# Altium project EC-Sensor-Module.PrjPcb
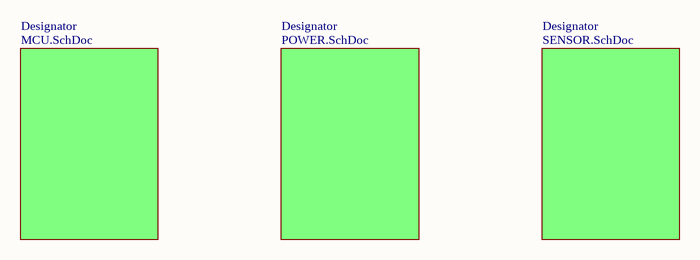
[diagram p0: Integrate.SchDoc]
SoftwareVersion: AD20; VersionRevision: Rev1; Project: Electrochemical Sensor Module; Name: MosesChan; Company: Yeejoin
4 sheets, 57 parts. Net scope: flat (ports and power ports of the same name join across sheets).
Sheets:
  Integrate.SchDoc
    Designator = MCU.SchDoc
    Designator = POWER.SchDoc
    Designator = SENSOR.SchDoc

## Sheet Integrate.SchDoc
size A

### Sub-sheets
Designator = MCU.SchDoc: no entries
Designator = POWER.SchDoc: no entries
Designator = SENSOR.SchDoc: no entries

## Sheet MCU.SchDoc
size A
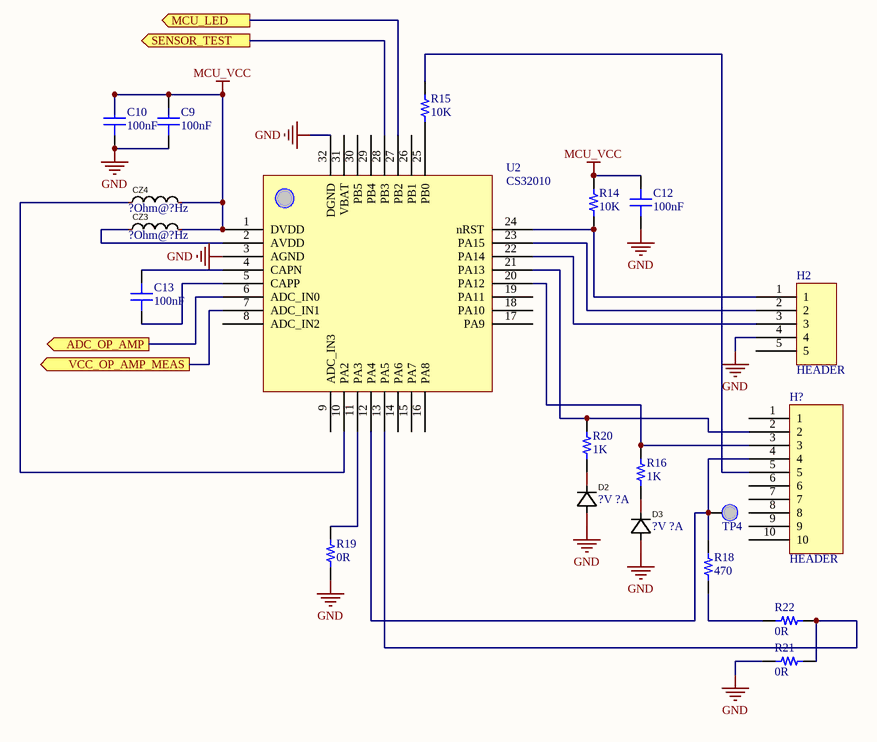
[diagram p1: MCU.SchDoc]

### Parts
(Parts that share a designator on the sheet are numbered #1, #2 ... from top to bottom, then left to right.)
C9  100nF  [0603_C]
C10  100nF  [0603_C]
C12  100nF  [0603_C]
C13  100nF  [0603_C]
CZ3  ?Ohm@?Hz  [L0603]
CZ4  ?Ohm@?Hz  [L0603]
D2  ?V ?A
D3  ?V ?A
H2  HEADER
H?  HEADER
R14  10K  [0402_R]
R15  10K  [0402_R]
R16  1K  [0402_R]
R18  470  [0402_R]
R19#1  0R  [0402_R]
R20  1K  [0402_R]
R21  0R  [0402_R]
R22#1  0R  [0402_R]
TP4  TP  (value not drawn)
U2  CS32010  (net tie)

### Ports
ADC_OP_AMP (out), MCU_LED (out), SENSOR_TEST (out), VCC_OP_AMP_MEAS (out)

### Nets
GND: C9.1 C10.1 C12.1 D2.2(A) D3.2(A) H2.4 R19#1.1 R21.2 U2.3(AGND) U2.32(DGND)
MCU_VCC: C9.2 C10.2 C12.2 CZ3.2 CZ4.2 R14.2 U2.1(DVDD)
NetC3_2: U2.28(PB3) ; port SENSOR_TEST
NetC4_1: U2.7(ADC_IN1) ; port VCC_OP_AMP_MEAS
NetC13_1: C13.1 U2.5(CAPP)
NetC13_2: C13.2 U2.4(CAPN)
NetCZ3_1: CZ3.1 U2.2(AVDD)
NetCZ4_1: CZ4.1 U2.10(PA2)
NetD2_1: D2.1(K) R20.1
NetD3_1: D3.1(K) R16.1
NetH2_1: H2.1 R14.1 U2.24(nRST)
NetH2_2: H2.2 U2.23(PA15)
NetH2_3: H2.3 U2.22(PA14)
NetH?_2: H?.2 R20.2 U2.21(PA13)
NetH?_3: H?.3 R16.2 U2.20(PA12)
NetH?_4: H?.4 R18.2 TP4.8 U2.12(PA4)
NetH?_5: H?.5 R15.1
NetR5_2: U2.27(PB2) ; port MCU_LED
NetR9_2: U2.6(ADC_IN0) ; port ADC_OP_AMP
NetR15_2: R15.2 U2.25(PB0)
NetR18_1: R18.1 R22#1.2
NetR19#1_2: R19#1.2 U2.11(PA3)
NetR21_1: R21.1 R22#1.1 U2.13(PA5)

Not connected (* = marked no-connect by the designer): H2 5; H? 1 6 7 8 9 10; U2 8(ADC_IN2) 9(ADC_IN3) 14(PA6) 15(PA7) 16(PA8) 17(PA9) 18(PA10) 19(PA11) 26(PB1) 29(PB4) 30(PB5) 31(VBAT)

### Library data of the parts
C9 C10 C12 C13 = C0603: SMT Capacitor
CZ3 CZ4 = Bead: Common Smd Bead; Manufacturer: muRata(村田); Name: BLM18AG601SN1D; Add into BOM: yes; Impedance @ Frequency: 600Ω@100MHz; Tolerance: ±25%; DC Resistance: 380mΩ; Current Rating: 500mA; Circuits: 1; Symbol: BLM18AG601SN1D; Device: BLM18AG601SN1D; LCSC Part Name: 单路 0603磁珠 阻抗600Ω@100MHz; Supplier Part: C19330; Manufacturer Part: BLM18AG601SN1D; Supplier Footprint: 0603; JLCPCB Part Class: Extended Part; Datasheet: https://atta.szlcsc.com/upload/public/pdf/source/20180326/C19330_93F4AC33FF94C8E22511353688ADC0FA.pdf; Supplier: LCSC; Convert to PCB: yes
D2 D3 = Diode: Manufacturer: TWGMC(台湾迪嘉); Name: 1N4007; Symbol: 1N4007_C727081; Add into BOM: yes; Forward Voltage (Vf@If): 1.1V 1A; Reverse Leakage Current: 5uA 1kV; Reverse Voltage (Vr): 1kV; Diode Configuration: 独立式; Average Rectified Current (Io): 1A; Device: 1N4007_C727081; LCSC Part Name: 1N4007; Supplier Part: C727081; Manufacturer Part: 1N4007; Supplier Footprint: SMA(DO-214AC); JLCPCB Part Class: Extended Part; Datasheet: https://atta.szlcsc.com/upload/public/pdf/source/20200828/C727079_3A05254382567072883400655AE0ED46.pdf; Supplier: LCSC; Convert to PCB: yes
H2 = HEADER 5: 2.54mm spacing HEADER
H? = HEADER 10: 2.54mm spacing HEADER
R14-R16 R18 R19#1 R20 R21 R22#1 = R0402: SMT Resistor
TP4 = TP: Test Point
U2 = CS32010: ChipSea Microcontroller

## Sheet POWER.SchDoc
size A
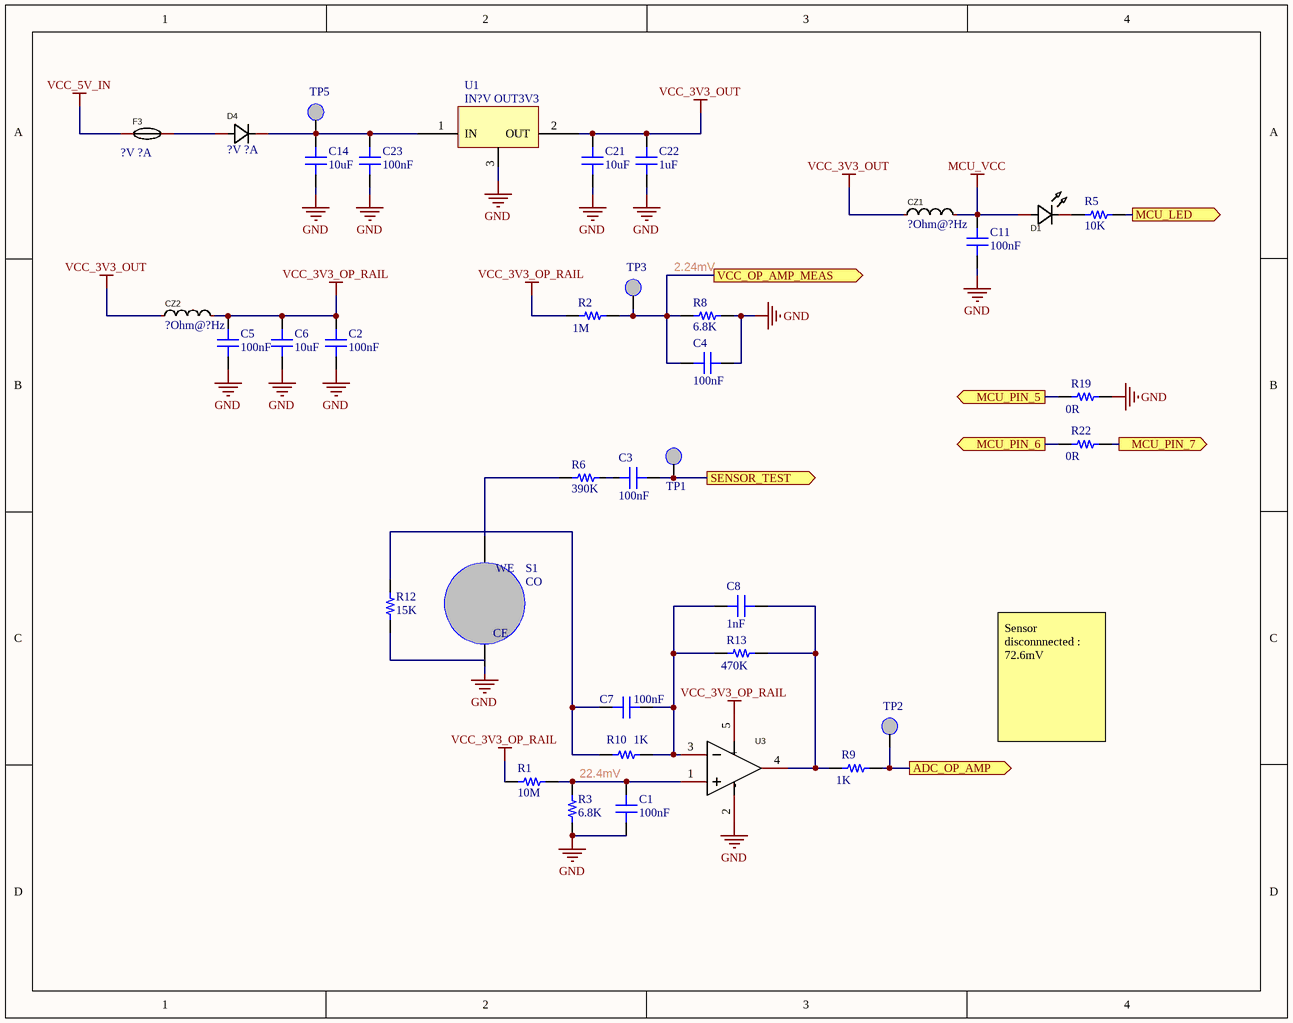
[diagram p2: POWER.SchDoc]

### Parts
(Parts that share a designator on the sheet are numbered #1, #2 ... from top to bottom, then left to right.)
C1  100nF  [0402_C]
C2  100nF  [0402_C]
C3  100nF  [0402_C]
C4  100nF  [0402_C]
C5  100nF  [0402_C]
C6  10uF  [0402_C]
C7  100nF  [0402_C]
C8  1nF  [0402_C]
C11  100nF  [0402_C]
C14  10uF  [0603_C]
C21  10uF  [0603_C]
C22  1uF  [0402_C]
C23  100nF  [0402_C]
CZ1  ?Ohm@?Hz  [L0603]
CZ2  ?Ohm@?Hz  [L0603]
D1  MHK1375CRBTD  [LED-TH_MHK1375CRBTD]  (value not drawn)
D4  ?V ?A
F3  ?V ?A  [F1206]
R1  10M  [0402_R]
R2  1M  [0402_R]
R3  6.8K  [0402_R]
R5  10K  [0402_R]
R6  390K  [0402_R]
R8  6.8K  [0402_R]
R9  1K  [0402_R]
R10  1K  [0402_R]
R12  15K  [0402_R]
R13  470K  [0402_R]
R19#2  0R  [0402_R]
R22#2  0R  [0402_R]
S1  CO
TP1  TP  (value not drawn)
TP2  TP  (value not drawn)
TP3  TP  (value not drawn)
TP5  TP  (value not drawn)
U1  IN?V OUT3V3
U3  Op-Amp  [SOT-23-5_L3.0-W1.7-P0.95-LS2.8-BR]  (value not drawn)

### Ports
ADC_OP_AMP (out), MCU_LED (out), MCU_PIN_5 (out), MCU_PIN_6 (out), MCU_PIN_7 (out), SENSOR_TEST (out), VCC_OP_AMP_MEAS (out)

### Nets
GND: C1.2 C2.2 C4.2 C5.2 C6.2 C11.2 C14.1 C21.1 C22.2 C23.2 R3.2 R8.2 R19#2.2 S1.6 U1.3(GND) U3.2(-)
MCU_VCC: C11.1 CZ1.2 D1.1(A)
VCC_3V3_OP_RAIL: C2.1 C5.1 C6.1 CZ2.2 R1.2 R2.1 U3.5(+)
VCC_3V3_OUT: C21.2 C22.1 CZ1.1 CZ2.1 U1.2(OUT)
VCC_5V_IN: F3.1
NetC1_1: C1.1 R1.1 R3.1 U3.1(+IN)
NetC3_1: C3.1 R6.1
NetC3_2: C3.2 TP1.8 ; port SENSOR_TEST
NetC4_1: C4.1 R2.2 R8.1 TP3.8 ; port VCC_OP_AMP_MEAS
NetC7_1: C7.1 R10.2 R12.1
NetC7_2: C7.2 C8.1 R10.1 R13.1 U3.3(-IN)
NetC8_2: C8.2 R9.1 R13.2 U3.4(OUT)
NetC14_2: C14.2 C23.1 D4.1(K) TP5.8 U1.1(IN)
NetD1_2: D1.2(K) R5.1
NetD4_2: D4.2(A) F3.2
NetR5_2: R5.2 ; port MCU_LED
NetR6_2: R6.2 S1.7
NetR9_2: R9.2 TP2.8 ; port ADC_OP_AMP
NetR19#2_1: R19#2.1 ; port MCU_PIN_5
NetR22#2_1: R22#2.1 ; port MCU_PIN_6
NetR22#2_2: R22#2.2 ; port MCU_PIN_7

Not connected (* = marked no-connect by the designer): R12 2

### Notes on the sheet
- 2.24mV
- 22.4mV
- Sensor disconnnected :
  72.6mV
- (in symbol EC Sensor) WE; CE

### Library data of the parts
C1-C8 C11 C22 C23 = C0402: SMT Capacitor
C14 C21 = C0603: SMT Capacitor
CZ1 CZ2 = Bead: as CZ3 on sheet MCU; Symbol: BLM18AG601SN1D; Device: BLM18AG601SN1D; LCSC Part Name: 单路 0603磁珠 阻抗600Ω@100MHz; Supplier Part: C19330; Manufacturer Part: BLM18AG601SN1D; Supplier Footprint: 0603; JLCPCB Part Class: Extended Part; Datasheet: https://atta.szlcsc.com/upload/public/pdf/source/20180326/C19330_93F4AC33FF94C8E22511353688ADC0FA.pdf; Supplier: LCSC; Convert to PCB: yes
D1 = LED: Light Emitting Diode; Manufacturer: MEIHUA(美华); Add into BOM: yes; Emitted Color: 红灯; Lens Color: 雾状红; Dominant Wavelength: 628nm; Forward Current: 20mA; Power Dissipation: 75mW; Viewing Angle: 60°; Lamp Holder Type: 组装式圆形灯头; Name: MHK1375CRBTD; Symbol: MHK1375CRBTD; Device: MHK1375CRBTD; LCSC Part Name: 红灯 LED货套单LED; Supplier Part: C2764901; Manufacturer Part: MHK1375CRBTD; Supplier Footprint: 插件,P=2.54mm; JLCPCB Part Class: Extended Part; Datasheet: https://atta.szlcsc.com/upload/public/pdf/source/20210406/C2764901_ED37C4554FC3F5D00E757EC836FABC51.pdf; Supplier: LCSC; Convert to PCB: yes; Diode Configuration: -; Peak Wavelength: -; Color Temperature: -; Mounting Sytle: -; Operating Temperature: -25℃~+85℃
D4 = Diode: as D2 on sheet MCU; Device: 1N4007_C727081; LCSC Part Name: 1N4007; Supplier Part: C727081; Manufacturer Part: 1N4007; Supplier Footprint: SMA(DO-214AC); JLCPCB Part Class: Extended Part; Datasheet: https://atta.szlcsc.com/upload/public/pdf/source/20200828/C727079_3A05254382567072883400655AE0ED46.pdf; Supplier: LCSC; Convert to PCB: yes
F3 = JK-nSMD010/60V: Resettable Fuse; Manufacturer: JK(金科); Add into BOM: yes; Name: JK-nSMD010/60V; Symbol: JK-NSMD010/60V; Device: JK-nSMD010/60V; LCSC Part Name: 100mA 60V; Supplier Part: C2830236; Manufacturer Part: JK-nSMD010/60V; Supplier Footprint: SMD1206; JLCPCB Part Class: Extended Part; Datasheet: https://atta.szlcsc.com/upload/public/pdf/source/20210427/C2830251_B9511B640A50AD6A91174E2DDDD254CA.pdf; Supplier: LCSC; Convert to PCB: yes
R1-R3 R5 R6 R8-R10 R12 R13 R19#2 R22#2 = R0402: SMT Resistor
S1 = EC Sensor: EC Sensor 2 Pin
TP1-TP3 TP5 = TP: Test Point
U1 = LDO: Low Dropout Regulator
U3 = Op-Amp: Single Op-Amp In SOT-23-5; Manufacturer: Gainsil(聚洵); Name: LMV321-TR; Add into BOM: yes; Symbol: LMV321-TR; Device: LMV321-TR; LCSC Part Name: 低功耗,轨到轨输入输出,1通道运放; Supplier Part: C362273; Manufacturer Part: LMV321-TR; Supplier Footprint: SOT-23-5; JLCPCB Part Class: Extended Part; Datasheet: https://atta.szlcsc.com/upload/public/pdf/source/20220610/6BCF6B2E6D346723E41E276410E02207.pdf; Supplier: LCSC; Convert to PCB: yes; Number of Circuits: -

## Sheet SENSOR.SchDoc
size A

## Nets that join several sheets
GND: MCU (10 pins), POWER (16 pins)
MCU_VCC: MCU (7 pins), POWER (C11.1 CZ1.2 D1.1)
NetC3_2: MCU (U2.28), POWER (C3.2 TP1.8)
NetC4_1: MCU (U2.7), POWER (C4.1 R2.2 R8.1 TP3.8)
NetR5_2: MCU (U2.27), POWER (R5.2)
NetR9_2: MCU (U2.6), POWER (R9.2 TP2.8)